# Altium project BMS Master.PrjPcb
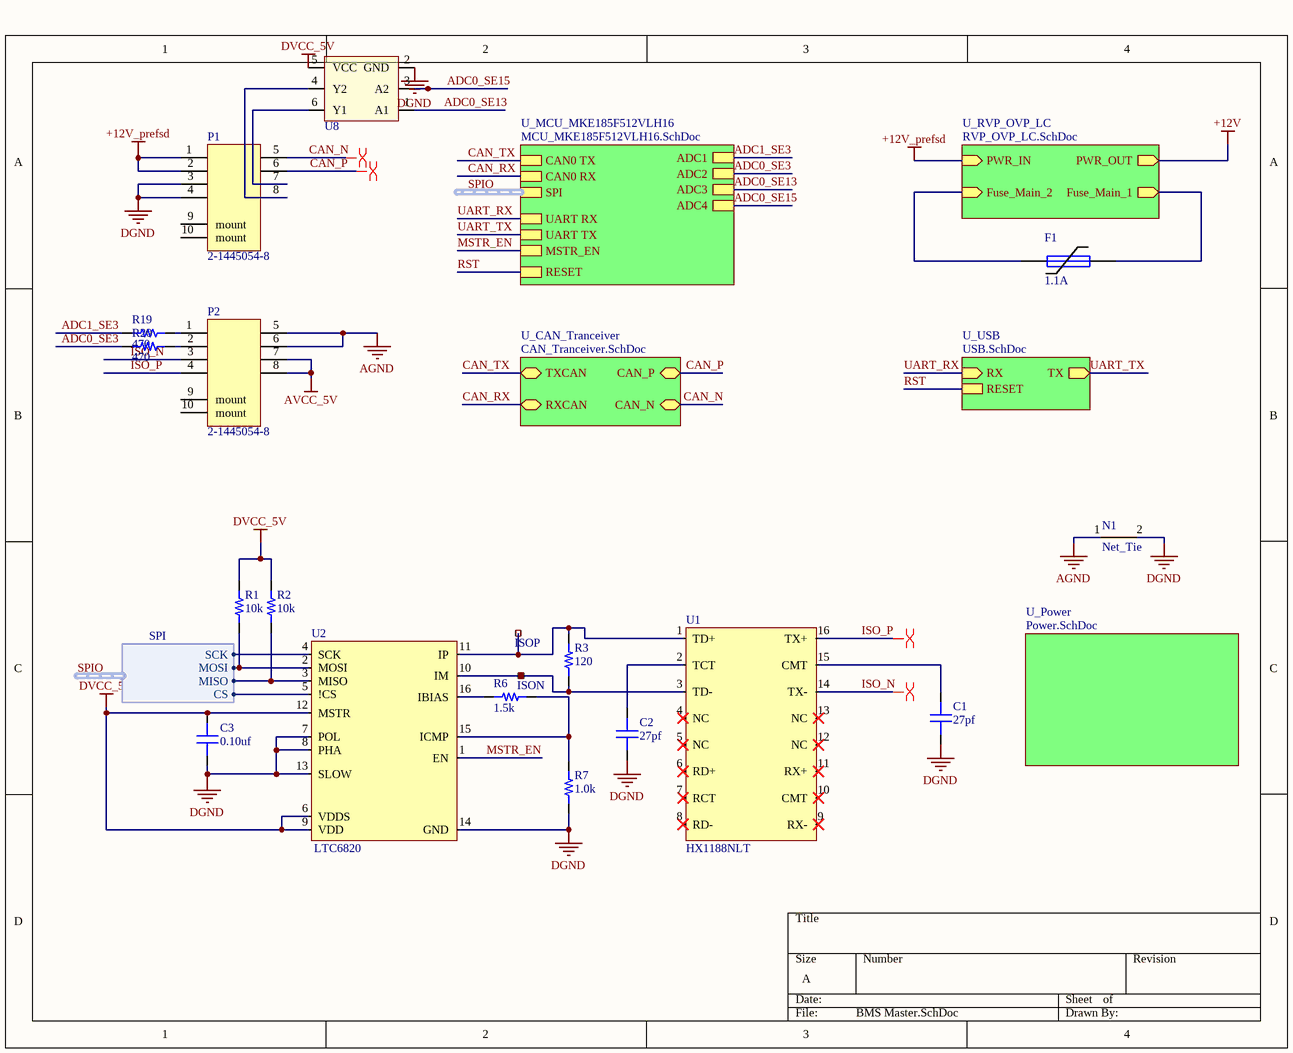
[diagram p0: BMS Master.SchDoc]
6 sheets, 76 parts. Net scope: hierarchical (ports join the sheet entries above them; power ports are global).
Board files: BMS Master.PcbDoc, BMS Master brd2.PcbDoc, BMS Master 3.PcbDoc
Sheets:
  BMS Master.SchDoc
    U_CAN_Tranceiver = CAN_Tranceiver.SchDoc
    U_RVP_OVP_LC = RVP_OVP_LC.SchDoc
    U_USB = USB.SchDoc
    U_MCU_MKE185F512VLH16 = MCU_MKE185F512VLH16.SchDoc
    U_Power = Power.SchDoc

## Sheet BMS Master.SchDoc
size A; DrawnBy: Not Alvin Ha

### Parts
C1  value 27pf  [CAP 0603/1608]  (hidden comment: Capacitor MLCC 27pf 25V CAP 0603/1608)
C2  value 27pf  [CAP 0603/1608]  (hidden comment: Capacitor MLCC 27pf 25V CAP 0603/1608)
C3  value 0.10uf  [CAP 0603/1608]  (hidden comment: Capacitor MLCC 0.10uf 25V CAP 0603/1608)
F1  I_hold: 1.1A  [PTC Fuse 1206/3216]  (hidden comment: 2.2A)
ISON  RCU-0C  [RCU-0C]  (value not drawn)
ISOP  RCU-0C  [RCU-0C]  (value not drawn)
N1  Net_Tie  [Net_Tie]  (net tie, no BOM)
P1  2-1445054-8  [2-1445054-8]
P2  2-1445054-8  [2-1445054-8]
R1  value 10k  [RES 0603/1608]  (hidden comment: Resistor 10k 0603 1/10W 5%)
R2  value 10k  [RES 0603/1608]  (hidden comment: Resistor 10k 0603 1/10W 5%)
R3  value 120  [RES 0603/1608]  (hidden comment: Resistor 120 0603 1/10W 5%)
R6  value 1.5k  [RES 0603/1608]  (hidden comment: Resistor 1.5k 0603 1/10W 5%)
R7  value 1.0k  [RES 0603/1608]  (hidden comment: Resistor 1.0k 0603 1/10W 5%)
R19  value 470  [RES 0603/1608]  (hidden comment: Resistor 470 0603 1/10W 5%)
R20  value 470  [RES 0603/1608]  (hidden comment: Resistor 470 0603 1/10W 5%)
U1  HX1188NLT  [HX1188NLT]
U2  LTC6820  [MSOP-16]
U8  comment  [6-TSSOP]  (value not drawn)

### Sub-sheets
U_CAN_Tranceiver = CAN_Tranceiver.SchDoc: TXCAN (bidir), RXCAN (bidir), CAN_P (bidir), CAN_N (bidir)
U_MCU_MKE185F512VLH16 = MCU_MKE185F512VLH16.SchDoc: CAN0 TX, CAN0 RX, ADC4, ADC3, ADC2, ADC1, SPI (harness *), MSTR_EN, UART RX, UART TX, RESET
U_Power = Power.SchDoc: no entries
U_RVP_OVP_LC = RVP_OVP_LC.SchDoc: PWR_IN (in), PWR_OUT (out), Fuse_Main_2 (in), Fuse_Main_1 (out)
U_USB = USB.SchDoc: TX (out), RX (in), RESET

### Harnesses
SPI: SCK, MOSI, MISO, CS

### Nets
+12V: F1.1 ; sheet U_RVP_OVP_LC/PWR_OUT, sheet U_RVP_OVP_LC/Fuse_Main_2
+12V_prefsd: F1.2 P1.1 P1.2 ; sheet U_RVP_OVP_LC/PWR_IN, sheet U_RVP_OVP_LC/Fuse_Main_1
AGND: N1.1 P2.5 P2.6
AVCC_5V: P2.7 P2.8
DGND: C1.1 C2.1 C3.2 N1.2 P1.3 P1.4 R7.1 U2.7(POL) U2.8(PHA) U2.13(SLOW) U2.14(GND) U8.2(GND)
DVCC_5V: C3.1 R1.2 R2.2 U2.6(VDDS) U2.9(VDD) U2.12(MSTR) U8.5(VCC)
ADC0_SE3: R20.1 ; sheet U_MCU_MKE185F512VLH16/ADC2
ADC0_SE13: U8.1(A1) ; sheet U_MCU_MKE185F512VLH16/ADC3
ADC0_SE15: U8.3(A2) ; sheet U_MCU_MKE185F512VLH16/ADC4
ADC1_SE3: R19.1 ; sheet U_MCU_MKE185F512VLH16/ADC1
CAN_N: P1.5 ; sheet U_CAN_Tranceiver/CAN_N
CAN_P: P1.6 ; sheet U_CAN_Tranceiver/CAN_P
CAN_RX: sheet U_CAN_Tranceiver/RXCAN, sheet U_MCU_MKE185F512VLH16/CAN0 RX
CAN_TX: sheet U_CAN_Tranceiver/TXCAN, sheet U_MCU_MKE185F512VLH16/CAN0 TX
cs: U2.5(!CS) ; sheet U_MCU_MKE185F512VLH16/SPI.CS
ISO_N: P2.3 U1.14(TX-)
ISO_P: P2.4 U1.16(TX+)
MSTR_EN: U2.1(EN) ; sheet U_MCU_MKE185F512VLH16/MSTR_EN
RST: sheet U_USB/RESET, sheet U_MCU_MKE185F512VLH16/RESET  [project net JTAG_RST]
SPIO.MISO: R2.1 U2.3(MISO) ; sheet U_MCU_MKE185F512VLH16/SPI.MISO
SPIO.MOSI: R1.1 U2.2(MOSI) ; sheet U_MCU_MKE185F512VLH16/SPI.MOSI
SPIO.SCK: U2.4(SCK) ; sheet U_MCU_MKE185F512VLH16/SPI.SCK
UART_RX: sheet U_USB/RX, sheet U_MCU_MKE185F512VLH16/UART RX  [project net FTDI_UART_RX]
UART_TX: sheet U_USB/TX, sheet U_MCU_MKE185F512VLH16/UART TX  [project net FTDI_UART_TX]
NetC1_2: C1.2 U1.15(CMT)
NetC2_2: C2.2 U1.2(TCT)
NetISON_1: ISON.1 R3.1 U1.3(TD-) U2.10(IM)
NetISOP_1: ISOP.1 R3.2 U1.1(TD+) U2.11(IP)
NetP1_7: P1.7 U8.6(Y1)
NetP1_8: P1.8 U8.4(Y2)
NetP2_1: P2.1 R19.2
NetP2_2: P2.2 R20.2
NetR6_1: R6.1 U2.16(IBIAS)
NetR6_2: R6.2 R7.2 U2.15(ICMP)

Not connected (* = marked no-connect by the designer): P1 9(mount) 10(mount); P2 9(mount) 10(mount); U1 4(NC)* 5(NC)* 6(RD+)* 7(RCT)* 8(RD-)* 9(RX-)* 10(CMT)* 11(RX+)* 12(NC)* 13(NC)*

### Buses and harness runs
harness SPIO = sheet U_MCU_MKE185F512VLH16/SPI

### Layout directives
differential pair: CAN_N, CAN_P, ISO_N, ISO_P

### Library data of the parts
C1 C2 = 515: Manufacturer_id: 1; idCapacitor: 515; Name: Cap_27pf_25V_CAP 0603/1608; Dielectric: Ceramic; Created_By: Nick Mah; Drawer_id: 1; Voltage_Rating: 25V; Package: CAP 0603/1608; Created_Date: 10/20/2018
C3 = 583: Manufacturer_id: 1; idCapacitor: 583; Name: Cap_0.10uf_25V_CAP 0603/1608; Dielectric: Ceramic; Created_By: Nick Mah; Drawer_id: 1; Voltage_Rating: 25V; Package: CAP 0603/1608; Created_Date: 10/20/2018
F1 = 8: Fuse; Manufacturer_id: 1; MfrPartNo: 1206L110/12SLYR; idFuse: 8; Name: Resettable; I_max: 50A; V_max: 12V; Pd_Typ: .8W; Published: 8-Jun-2000; LatestRevisionDate: 17-Jul-2002; LatestRevisionNote: Re-released for DXP Platform.; PackageReference: PIN-W2/E2.8; Publisher: Altium Limited; PackageDescription: Thru-Hole; 2 Leads; Drawer_id: 1; I_trip: 2.2A; Link: https://www.digikey.com/product-detail/en/littelfuse-inc/1206L110-12SLYR/F5764CT-ND/3593809
ISON ISOP = 14: Test point; Manufacturer_id: 1; idConn: 14; Value: CONN; Created_By: Graydon; Updated_By: Null; Drawer_id: 1; Name: RCU-0C; Num_Contacts: 1; Num_Rows: 1; Package: RCU-0C; MfrPartNo: RCU-0C; Link: https://www.digikey.com/product-detail/en/te-connectivity-amp-connectors/RCU-0C/A106145CT-ND/3477802; ComponentLink1Description: Null; ComponentLink1URL: Null; Supplier1: None; Supplier1PartNo: None; Created_Date: 11/10/2018
N1 = 1: Manufacturer_id: 1; idFuse: 3; Name: Net Tie; Drawer_id: 1; idShunt: 1
P1 P2 = 12: 1x8 connector; Manufacturer_id: 5; idConn: 12; Drawer_id: 1; Name: Micro MATE-N-LOK 1x8; Num_Contacts: 8; Created_By: Graydon; Num_Rows: 1; MfrPartNo: 2-1445054-8; Link: https://www.digikey.com/product-detail/en/te-connectivity-amp-connectors/2-1445054-8/2-1445054-8-ND/1890093; ComponentLink1Description: Datasheet; Supplier1: Digi-Key; Supplier1PartNo: 2-1445054-8-ND; Created_Date: 11/10/2018
R1 R2 = 1393: Manufacturer_id: 1; idResistor: 1393; Name: Res_10k_0603_1/10W_5%; Created_By: Nick Mah; Supplier 1: Digi-Key; Drawer_id: 1; Tolerance: 5%; Power: 1/10W; Package: 0603; ComponentLink1Description: Datasheet; Created_Date: 2018-10-20
R3 = 1347: Manufacturer_id: 1; idResistor: 1347; Name: Res_120_0603_1/10W_5%; Created_By: Nick Mah; Supplier 1: Digi-Key; Drawer_id: 1; Tolerance: 5%; Power: 1/10W; Package: 0603; ComponentLink1Description: Datasheet; Created_Date: 2018-10-20
R6 = 1373: Manufacturer_id: 1; idResistor: 1373; Name: Res_1.5k_0603_1/10W_5%; Created_By: Nick Mah; Supplier 1: Digi-Key; Drawer_id: 1; Tolerance: 5%; Power: 1/10W; Package: 0603; ComponentLink1Description: Datasheet; Created_Date: 2018-10-20
R7 = 1369: Manufacturer_id: 1; idResistor: 1369; Name: Res_1.0k_0603_1/10W_5%; Created_By: Nick Mah; Supplier 1: Digi-Key; Drawer_id: 1; Tolerance: 5%; Power: 1/10W; Package: 0603; ComponentLink1Description: Datasheet; Created_Date: 2018-10-20
R19 R20 = 1361: Manufacturer_id: 1; idResistor: 1361; Name: Res_470_0603_1/10W_5%; Created_By: Nick Mah; Supplier 1: Digi-Key; Drawer_id: 1; Tolerance: 5%; Power: 1/10W; Package: 0603; ComponentLink1Description: Datasheet; Created_Date: 2018-10-20
U1 = 8: Manufacturer_id: 1; idFuse: 3; idIC_Interface: 8; Num_Circuits: 2; Created_By: Angel; Drawer_id: 1; Name: HX1188NLT; Type: Magnetic Isolation; Package: HX1188NLT; MfrPartNo: HX1188NLT; Link: https://www.digikey.com/product-detail/en/pulse-electronics-network/HX1188NLT/553-1536-1-ND/3151809?utm_adgroup=Transformers&slid=&gclid=CjwKCAiAhp_jBRAxEiwAXbniXRrdDycXKcdMEppGgTacWMJf80VG2GQDdYxlb9yRzxEZsto0mBbjlhoCtm4QAvD_BwE
U2 = 7: soSPI Isolated / Communications Interface; Manufacturer_id: 1; idFuse: 3; idIC_Interface: 7; Protocol: isoSPI; Vin(Min): 2.7V; Vin(Max): 5.5V; Created_By: Angel; Drawer_id: 1; Name: LTC6820; Type: bidirectional; Num_Circuits: 1; Package: MSOP-16; MfrPartNo: LTC6820; Link: https://www.mouser.com/ProductDetail/Analog-Devices/LTC6820IMSPBF?qs=sGAEpiMZZMvi6wO7nhr1LyTLeBC7dAWQpR44bZH0zYY%3d
U8 = 10: Buffer dual high speed; Manufacturer_id: 1; MfrPartNo: NC7WZ07P6X; idIC_Interface: 10; Name: Buffer 2x; Value: None; Num_Circuits: 2; Data_Rate: 2.3ns; Vin(Min): 1.65V; Vin(Max): 5.5V; Created_By: gray; Updated_By: Null; Drawer_id: 1; Type: Buffer; Protocol: None; Package: 6-TSSOP; Link: https://www.digikey.com/product-detail/en/on-semiconductor/NC7WZ07P6X/NC7WZ07P6XCT-ND/965702; ComponentLink1Description: Digikey; ComponentLink1URL: https://www.digikey.com/product-detail/en/on-semiconductor/NC7WZ07P6X/NC7WZ07P6XCT-ND/965702; Supplier1: Digikey; Supplier1PartNo: NC7WZ07P6XCT-ND; Created_Date: 3/6/2019

## Sheet CAN_Tranceiver.SchDoc
size A
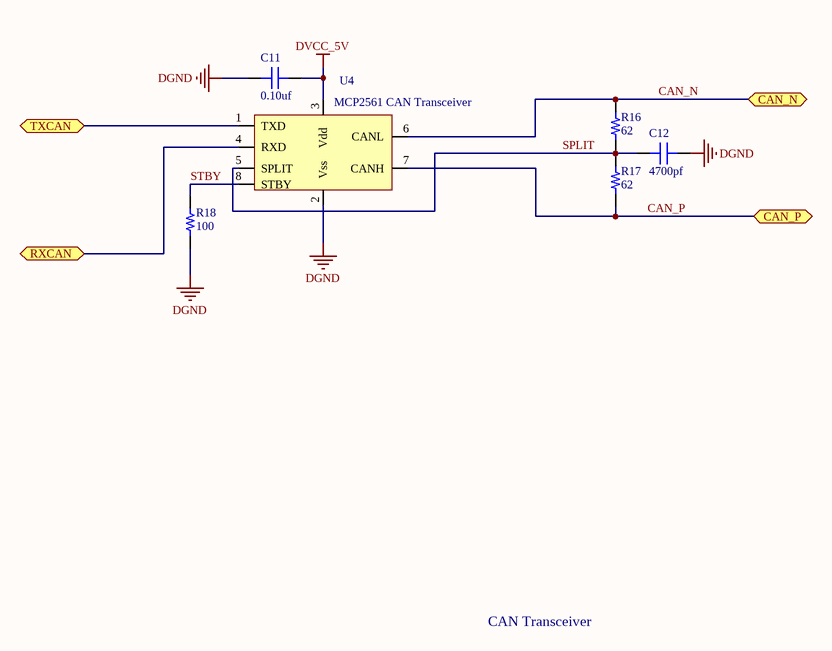
[diagram p1: CAN_Tranceiver.SchDoc]

### Parts
C11  value 0.10uf  [CAP 0603/1608]  (hidden comment: Capacitor MLCC 0.10uf 50V CAP 0603/1608)
C12  value 4700pf  [CAP 0603/1608]  (hidden comment: Capacitor MLCC 4700pf 50V CAP 0603/1608)
R16  value 62  [RES 0603/1608]  (hidden comment: Resistor 62 0603 1/10W 5%)
R17  value 62  [RES 0603/1608]  (hidden comment: Resistor 62 0603 1/10W 5%)
R18  value 100  [RES 0603/1608]  (hidden comment: Resistor 100 0603 1/10W 10%)
U4  MCP2561 CAN Transceiver  [SOIC-8]

### Ports
CAN_N (bidir), CAN_P (bidir), RXCAN (bidir), TXCAN (bidir)

### Nets
DGND: C11.1 C12.1 R18.1 U4.2(Vss)
DVCC_5V: C11.2 U4.3(Vdd)
CAN_N: R16.1 U4.6(CANL) ; port CAN_N
CAN_P: R17.2 U4.7(CANH) ; port CAN_P
CAN_RX: U4.4(RXD) ; port RXCAN
CAN_TX: U4.1(TXD) ; port TXCAN
SPLIT: C12.2 R16.2 R17.1 U4.5(SPLIT)
STBY: R18.2 U4.8(STBY)

### Notes on the sheet
- CAN Transceiver

### Library data of the parts
C11 = 943: Manufacturer_id: 1; idCapacitor: 943; Name: Cap_0.10uf_50V_CAP 0603/1608; Dielectric: Ceramic; Created_By: Nick Mah; Drawer_id: 1; Voltage_Rating: 50V; Package: CAP 0603/1608; Created_Date: 10/20/2018
C12 = 929: Manufacturer_id: 1; idCapacitor: 929; Name: Cap_4700pf_50V_CAP 0603/1608; Dielectric: Ceramic; Created_By: Nick Mah; Drawer_id: 1; Voltage_Rating: 50V; Package: CAP 0603/1608; Created_Date: 10/20/2018
R16 R17 = 1340: Manufacturer_id: 1; idResistor: 1340; Name: Res_62_0603_1/10W_5%; Created_By: Nick Mah; Supplier 1: Digi-Key; Drawer_id: 1; Tolerance: 5%; Power: 1/10W; Package: 0603; ComponentLink1Description: Datasheet; Created_Date: 2018-10-20
R18 = 2293: Manufacturer_id: 1; idResistor: 2293; Name: Res_100_0603_1/10W_10%; Created_By: Nick Mah; Supplier 1: Digi-Key; Drawer_id: 1; Tolerance: 10%; Power: 1/10W; Package: 0603; ComponentLink1Description: Datasheet; Created_Date: 2018-10-20
U4 = 5: Manufacturer_id: 1; idIC_Interface: 5; Value: CAN/UART; Data_Rate: 1Mbps; Vin(Min): 4.5V; Vin(Max): 5.5V; Created_By: Angel Delgado; Drawer_id: 1; Name: CAN Transceiver; Type: Transceiver; Protocol: CAN; Num_Circuits: 1; Package: SOIC-8; MfrPartNo: MCP2561; Link: https://www.digikey.com/product-detail/en/microchip-technology/MCP2561T-E-SN/MCP2561T-E-SNCT-ND/5148846

## Sheet RVP_OVP_LC.SchDoc
size A
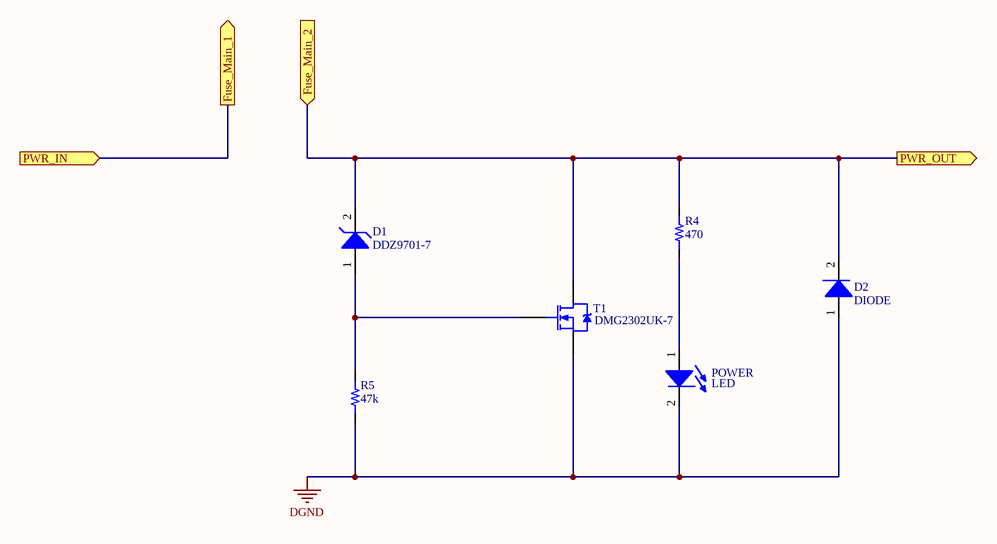
[diagram p2: RVP_OVP_LC.SchDoc]

### Parts
D1  DDZ9701-7  [SOD123F]
D2  DIODE  [SOD-128]
POWER  LED  [0805_LED]
R4  value 470  [RES 0603/1608]  (hidden comment: Resistor 470 0603 1/10W 5%)
R5  value 47k  [RES 0603/1608]  (hidden comment: Resistor 47k 0603 1/10W 5%)
T1  DMG2302UK-7  [SOT23-3]

### Ports
Fuse_Main_1 (out), Fuse_Main_2 (in), PWR_IN (in), PWR_OUT (out)

### Nets
+12V: D1.2(K) D2.2(K) R4.2 T1.3(D) ; port PWR_OUT, port Fuse_Main_2
+12V_prefsd: port PWR_IN, port Fuse_Main_1
DGND: D2.1(A) POWER.2(K) R5.1 T1.2(S)
NetD1_1: D1.1(A) R5.2 T1.1(G)
NetPOWER_1: POWER.1(A) R4.1

### Library data of the parts
D1 = 10: Zener Diode 14V 500mW ±5% Surface Mount SOD-123; Manufacturer_id: 8; idDiode: 10; Drawer_id: 1; Value: 14Vz; MfrPartNo: DDZ9701-7; Name: DDZ9701; Type: Zener; Num_Circuits: 1; Power: 500mW; Package: SOD-123; Link: https://www.digikey.com/product-detail/en/diodes-incorporated/DDZ9701-7/DDZ9701-7DICT-ND/3877402; ComponentLink1Description: Datasheet; ComponentLink1URL: https://www.diodes.com/assets/Datasheets/ds30410.pdf; Supplier1: Digi-Key; Supplier1PartNo: DDZ9701-7DICT-ND
D2 = 12: DIODE SCHOTTKY 30V 5A TMINIP2; Manufacturer_id: 1; idDiode: 12; Name: DB2431200L; Drawer_id: 1; Value: 5A; Type: Schottky; Num_Circuits: 1; Ic: 5A; Power: 30V; Package: SOD-128; MfrPartNo: DB2431200L; Link: https://www.digikey.com/product-detail/en/panasonic-electronic-components/DB2431200L/DB2431200LCT-ND/3884430; ComponentLink1Description: Datasheet; ComponentLink1URL: https://industrial.panasonic.com/content/data/SC/ds/ds4/DB2431200L_E.pdf; Supplier1: Digi-Key; Supplier1PartNo: DB2431200LCT-ND
POWER = 2: Manufacturer_id: 1; idLED: 2; Name: CMD17_0805_GREEN; Value: Green; Brightness: 7mcd; Id: 20mA; Vf: 2.1V; Drawer_id: 1; Package: 0805; Link: https://www.digikey.com/product-detail/en/visual-communications-company-vcc/CMD17-21VGD-TR8/L62505CT-ND/254936
R4 = 1361: as R19 on sheet BMS Master; Supplier 1: Digi-Key; Drawer_id: 1; Tolerance: 5%; Power: 1/10W; Package: 0603; ComponentLink1Description: Datasheet; Created_Date: 2018-10-20
R5 = 1409: Manufacturer_id: 1; idResistor: 1409; Name: Res_47k_0603_1/10W_5%; Created_By: Nick Mah; Supplier 1: Digi-Key; Drawer_id: 1; Tolerance: 5%; Power: 1/10W; Package: 0603; ComponentLink1Description: Datasheet; Created_Date: 2018-10-20
T1 = 6: MOSFET N-CHANNEL 30V 5A SOT23; Manufacturer_id: 1; idFETs: 6; Value: N_Channel; Vdss: 20V; Id: 2.8A; Rds_On: 90mOhm; Vgs(typ): 800mV; Vgs(Max): 1V; Created_By: Angel; Drawer_id: 1; Name: DMG2302UK-7; Num_Circuits: 1; Package: SOT-23; MfrPartNo: DMG2302UK-7; Link: https://www.digikey.com/product-detail/en/diodes-incorporated/DMG2302UK-7/DMG2302UK-7DICT-ND/6010163; Supplier1: Digi-Key

## Sheet USB.SchDoc
size A
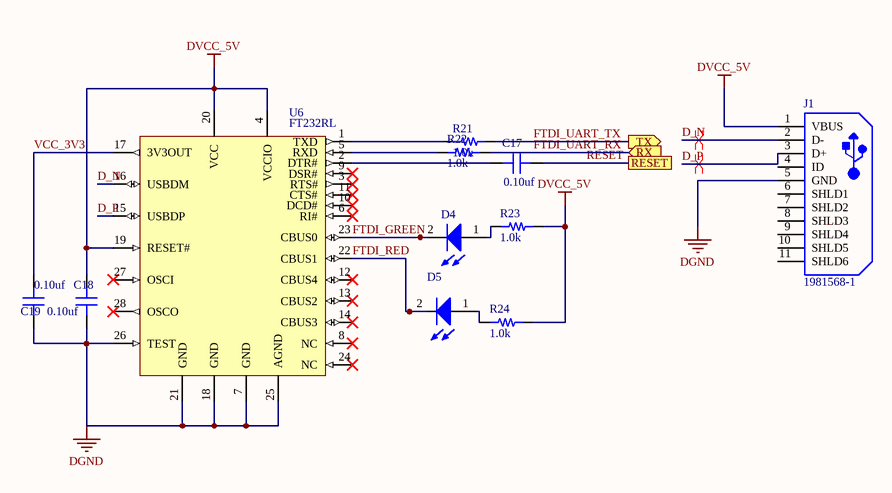
[diagram p3: USB.SchDoc]

### Parts
C17  value 0.10uf  [CAP 0603/1608]  (hidden comment: Capacitor MLCC 0.10uf 25V CAP 0603/1608)
C18  value 0.10uf  [CAP 0603/1608]  (hidden comment: Capacitor MLCC 0.10uf 25V CAP 0603/1608)
C19  value 0.10uf  [CAP 0603/1608]  (hidden comment: Capacitor MLCC 0.10uf 25V CAP 0603/1608)
D4  (no value)  [0805_LED]
D5  (no value)  [0805_LED]
J1  1981568-1  [TECO-1981568-5_V]
R21  value 1.0k  [RES 0603/1608]  (hidden comment: Resistor 1.0k 0603 1/10W 5%)
R22  value 1.0k  [RES 0603/1608]  (hidden comment: Resistor 1.0k 0603 1/10W 5%)
R23  value 1.0k  [RES 0603/1608]  (hidden comment: Resistor 1.0k 0603 1/10W 5%)
R24  value 1.0k  [RES 0603/1608]  (hidden comment: Resistor 1.0k 0603 1/10W 5%)
U6  FT232RL  [SSOP-28]

### Ports
RESET, RX (in), TX (out)

### Nets
DGND: C18.1 C19.1 J1.5(GND) U6.7(GND) U6.18(GND) U6.21(GND) U6.25(AGND) U6.26(TEST)
DVCC_5V: C18.2 J1.1(VBUS) R23.2 R24.2 U6.4(VCCIO) U6.19(RESET#) U6.20(VCC)
D_N: J1.2(D-) U6.16(USBDM)
D_P: J1.3(D+) U6.15(USBDP)
FTDI_GREEN: D4.2(K) U6.23(CBUS0)
FTDI_RED: D5.2(K) U6.22(CBUS1)
FTDI_UART_RX: R22.2 ; port RX
FTDI_UART_TX: R21.2 ; port TX
RESET: C17.2 ; port RESET  [project net JTAG_RST]
VCC_3V3: C19.2 U6.17(3V3OUT)
NetC17_1: C17.1 U6.2(DTR#)
NetD4_1: D4.1(A) R23.1
NetD5_1: D5.1(A) R24.1
NetR21_1: R21.1 U6.1(TXD)
NetR22_1: R22.1 U6.5(RXD)

Not connected (* = marked no-connect by the designer): J1 4(ID) 6(SHLD1) 7(SHLD2) 8(SHLD3) 9(SHLD4) 10(SHLD5) 11(SHLD6); U6 3(RTS#)* 6(RI#)* 8(NC)* 9(DSR#)* 10(DCD#)* 11(CTS#)* 12(CBUS4)* 13(CBUS2)* 14(CBUS3)* 24(NC)* 27(OSCI)* 28(OSCO)*

### Layout directives
differential pair; rule Matched Net Lengths [Tolerance = 0.254mm]: D_N
differential pair: D_P

### Library data of the parts
C17-C19 = 583: as C3 on sheet BMS Master; Drawer_id: 1; Voltage_Rating: 25V; Package: CAP 0603/1608; Created_Date: 10/20/2018
D4 = 2: as POWER on sheet RVP_OVP_LC; Drawer_id: 1; Link: https://www.digikey.com/product-detail/en/visual-communications-company-vcc/CMD17-21VGD-TR8/L62505CT-ND/254936; Package: 0805
D5 = 1: idLED: 1; Name: LED_0805_RED; Value: Red; Vf: 0.7V; Manufacturer_id: 1; Drawer_id: 1; Package: 0805
J1 = 5: USB Micro Type B; Manufacturer_id: 1; idConn: 5; Name: TE USB Micro; Value: CONN; Created_By: Aiku; MfrPartNo: 1981568-1; Drawer_id: 1; Num_Contacts: 5; Link: https://www.mouser.com/ProductDetail/TE-Connectivity-AMP/1981568-1?qs=sGAEpiMZZMulM8LPOQ%252bykzEIUPbUCiSfqsfxH3Oq%252bYo%3d; ComponentLink1Description: Datasheet; Supplier1: TE; Created_Date: 10/20/2018
R21-R24 = 1369: as R7 on sheet BMS Master; Supplier 1: Digi-Key; Drawer_id: 1; Tolerance: 5%; Power: 1/10W; Package: 0603; ComponentLink1Description: Datasheet; Created_Date: 2018-10-20
U6 = 3: Manufacturer_id: 1; idIC_Interface: 3; Name: USB FTDI; Protocol: UART; Vin(Min): 3.3; Vin(Max): 5.25; Created_By: Kyle; Drawer_id: 1; MfrPartNo: FT232RL; Link: https://www.digikey.com/product-detail/en/ftdi-future-technology-devices-international-ltd/FT232RL-REEL/768-1007-1-ND/1836402

## Sheet MCU_MKE185F512VLH16.SchDoc: Microcontroller
size A4; DrawnBy: Not Alvin Ha; DocumentNumber: MCU2018-2; Revision: 2.0; SheetNumber: 2; SheetTotal: 4
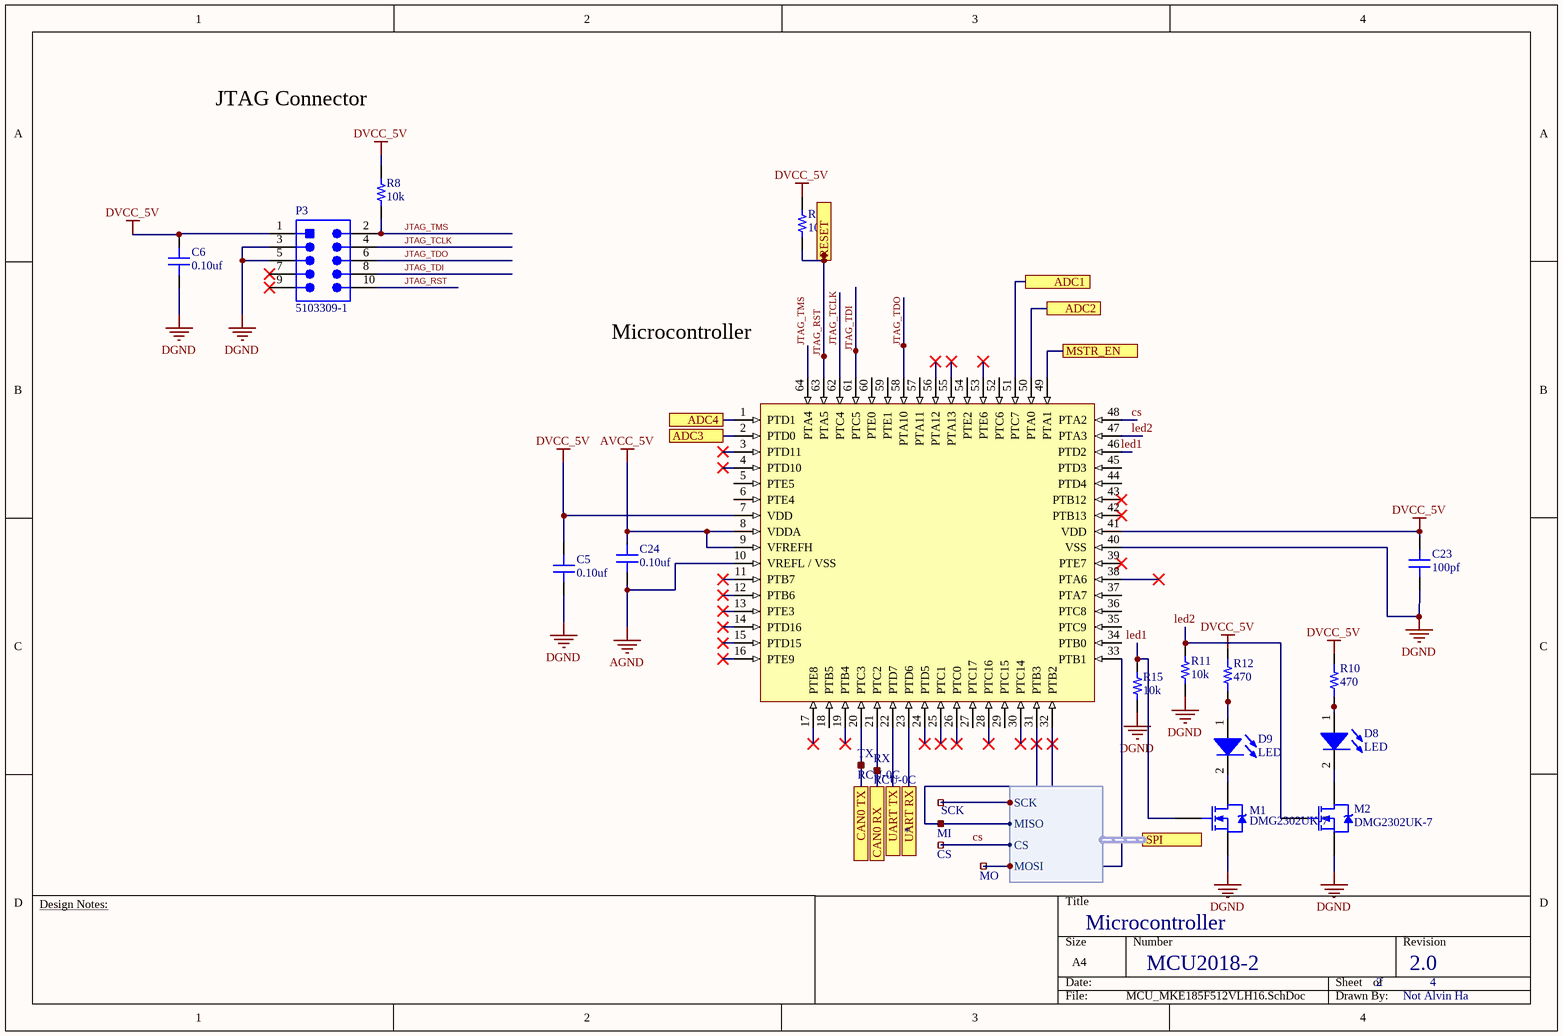
[diagram p4: MCU_MKE185F512VLH16.SchDoc]

### Parts
C5  value 0.10uf  [CAP 0603/1608]  (hidden comment: Capacitor MLCC 0.10uf 25V CAP 0603/1608)
C6  value 0.10uf  [CAP 0603/1608]  (hidden comment: Capacitor MLCC 0.10uf 16V CAP 0603/1608)
C23  value 100pf  [CAP 0603/1608]  (hidden comment: Capacitor MLCC 100pf 25V CAP 0603/1608)
C24  value 0.10uf  [CAP 0603/1608]  (hidden comment: Capacitor MLCC 0.10uf 25V CAP 0603/1608)
CS  RCU-0C  [RCU-0C]  (value not drawn)
D8  LED  [0805_LED]
D9  LED  [0805_LED]
M1  DMG2302UK-7  [SOT23-3]
M2  DMG2302UK-7  [SOT23-3]
MI  RCU-0C  [RCU-0C]  (value not drawn)
MO  RCU-0C  [RCU-0C]  (value not drawn)
P3  5103309-1  [HDR2X5_SMT]
R8  value 10k  [RES 0603/1608]  (hidden comment: Resistor 10k 0603 1/10W 1%)
R9  value 10k  [RES 0603/1608]  (hidden comment: Resistor 10k 0603 1/10W 5%)
R10  value 470  [RES 0603/1608]  (hidden comment: Resistor 470 0603 1/10W 5%)
R11  value 10k  [RES 0603/1608]  (hidden comment: Resistor 10k 0603 1/10W 1%)
R12  value 470  [RES 0603/1608]  (hidden comment: Resistor 470 0603 1/10W 5%)
R15  value 10k  [RES 0603/1608]  (hidden comment: Resistor 10k 0603 1/10W 1%)
RX  RCU-0C  [RCU-0C]
SCK  RCU-0C  [RCU-0C]  (value not drawn)
TX  RCU-0C  [RCU-0C]
U7  (no value)  [TQFP64]

### Ports
ADC1, ADC2, ADC3, ADC4, CAN0 RX, CAN0 TX, MSTR_EN, RESET, SPI (harness *), UART RX, UART TX

### Harnesses
*: SCK, MISO, CS, MOSI

### Nets
AGND: C24.1 U7.10(VREFL_/_VSS)
AVCC_5V: C24.2 U7.8(VDDA) U7.9(VFREFH)
DGND: C5.1 C6.1 C23.1 M1.2(S) M2.2(S) P3.3 P3.5 R11.1 R15.1 U7.40(VSS)
DVCC_5V: C5.2 C6.2 C23.2 P3.1 R8.2 R9.2 R10.2 R12.2 U7.7(VDD) U7.41(VDD)
ADC0_SE3: U7.50(PTA0) ; port ADC2
ADC0_SE13: U7.2(PTD0) ; port ADC3
ADC0_SE15: U7.1(PTD1) ; port ADC4
ADC1_SE3: U7.51(PTC7) ; port ADC1
CAN_RX: RX.1 U7.21(PTC2) ; port CAN0 RX
CAN_TX: TX.1 U7.20(PTC3) ; port CAN0 TX
cs: CS.1 U7.48(PTA2) ; port SPI.CS
FTDI_UART_RX: U7.23(PTD6) ; port UART RX
FTDI_UART_TX: U7.22(PTD7) ; port UART TX
JTAG_RST: P3.10 R9.1 U7.63(PTA5) ; port RESET
JTAG_TCLK: P3.4 U7.62(PTC4)
JTAG_TDI: P3.8 U7.61(PTC5)
JTAG_TDO: P3.6 U7.58(PTA10)
JTAG_TMS: P3.2 R8.1 U7.64(PTA4)
led1: M1.1(G) R15.2 U7.46(PTD2)
led2: M2.1(G) R11.2 U7.47(PTA3)
MSTR_EN: U7.49(PTA1) ; port MSTR_EN
SPIO.MISO: MI.1 U7.31(PTB3) ; port SPI.MISO
SPIO.MOSI: MO.1 U7.33(PTB1) ; port SPI.MOSI
SPIO.SCK: SCK.1 U7.32(PTB2) ; port SPI.SCK
NetD8_1: D8.1(A) R10.1
NetD8_2: D8.2(K) M2.3(D)
NetD9_1: D9.1(A) R12.1
NetD9_2: D9.2(K) M1.3(D)

Not connected (* = marked no-connect by the designer): P3 7* 9*; U7 3(PTD11)* 4(PTD10)* 5(PTE5) 6(PTE4) 11(PTB7)* 12(PTB6)* 13(PTE3)* 14(PTD16)* 15(PTD15)* 16(PTE9)* 17(PTE8)* 18(PTB5) 19(PTB4)* 24(PTD5)* 25(PTC1)* 26(PTC0)* 27(PTC17) 28(PTC16)* 29(PTC15) 30(PTC14)* 34(PTB0) 35(PTC9) 36(PTC8) 37(PTA7) 38(PTA6)* 39(PTE7)* 42(PTB13)* 43(PTB12)* 44(PTD4) 45(PTD3) 52(PTC6) 53(PTE6)* 54(PTE2) 55(PTA13)* 56(PTA12)* 57(PTA11) 59(PTE1) 60(PTE0)

### Notes on the sheet
- JTAG Connector
- Microcontroller
- Design Notes:

### Library data of the parts
C5 C24 = 583: as C3 on sheet BMS Master; Drawer_id: 1; Voltage_Rating: 25V; Package: CAP 0603/1608; Created_Date: 10/20/2018
C6 = 223: Manufacturer_id: 1; idCapacitor: 223; Name: Cap_0.10uf_16V_CAP 0603/1608; Dielectric: Ceramic; Created_By: Nick Mah; Drawer_id: 1; Voltage_Rating: 16V; Package: CAP 0603/1608; Created_Date: 10/20/2018
C23 = 529: Manufacturer_id: 1; idCapacitor: 529; Name: Cap_100pf_25V_CAP 0603/1608; Dielectric: Ceramic; Created_By: Nick Mah; Drawer_id: 1; Voltage_Rating: 25V; Package: CAP 0603/1608; Created_Date: 10/20/2018
CS MI MO RX SCK TX = 5: Manufacturer_id: 1; idTable: 5; Name: RCU-0C_Test_Point; Drawer_id: 1; Package: 0603; MfrPartNo: RCU-0C; Link: https://www.digikey.com/product-detail/en/te-connectivity-amp-connectors/RCU-0C/A106145CT-ND/3477802; ComponentLink1Description: Datasheet; ComponentLink1URL: https://www.te.com/commerce/DocumentDelivery/DDEController?Action=srchrtrv&DocNm=1773266&DocType=DS&DocLang=English
D8 D9 = 2: as POWER on sheet RVP_OVP_LC; Drawer_id: 1; Package: 0805; Link: https://www.digikey.com/product-detail/en/visual-communications-company-vcc/CMD17-21VGD-TR8/L62505CT-ND/254936
M1 M2 = 6: as T1 on sheet RVP_OVP_LC; MfrPartNo: DMG2302UK-7; Drawer_id: 1; Name: DMG2302UK-7; Num_Circuits: 1; Package: SOT-23; Link: https://www.digikey.com/product-detail/en/diodes-incorporated/DMG2302UK-7/DMG2302UK-7DICT-ND/6010163; Supplier1: Digi-Key
P3 = 4: 2 row connector; Manufacturer_id: 1; idConn: 4; Name: CONN_TE_2X5POS; Value: CONN; Voltage_Rating: None; Num_Contacts: 10; Num_Rows: 2; Pitch: 2.54mm; Created_By: Aiku; Drawer_id: 1; MfrPartNo: 5103309-1; Link: https://www.digikey.com/product-detail/en/5103309-1/A33160-ND/1114898?utm_campaign=buynow&WT.z_cid=ref_octopart_dkc_buynow&utm_medium=aggregator&curr=usd&site=us&utm_source=octopart; ComponentLink1Description: Datasheet
R8 R11 R15 = 313: Manufacturer_id: 1; idResistor: 313; Name: Res_10k_0603_1/10W_1%; Created_By: Nick Mah; Supplier 1: Digi-Key; Drawer_id: 1; Tolerance: 1%; Power: 1/10W; Package: 0603; ComponentLink1Description: Datasheet; Created_Date: 2018-10-20
R9 = 1393: as R1 on sheet BMS Master; Supplier 1: Digi-Key; Drawer_id: 1; Tolerance: 5%; Power: 1/10W; Package: 0603; ComponentLink1Description: Datasheet; Created_Date: 2018-10-20
R10 R12 = 1361: as R19 on sheet BMS Master; Supplier 1: Digi-Key; Drawer_id: 1; Tolerance: 5%; Power: 1/10W; Package: 0603; ComponentLink1Description: Datasheet; Created_Date: 2018-10-20
U7 = 1: idMCU: 1; Name: MKE18F512VLH16 MCU; Manufacturer_id: 1; Drawer_id: 1

## Sheet Power.SchDoc
size A
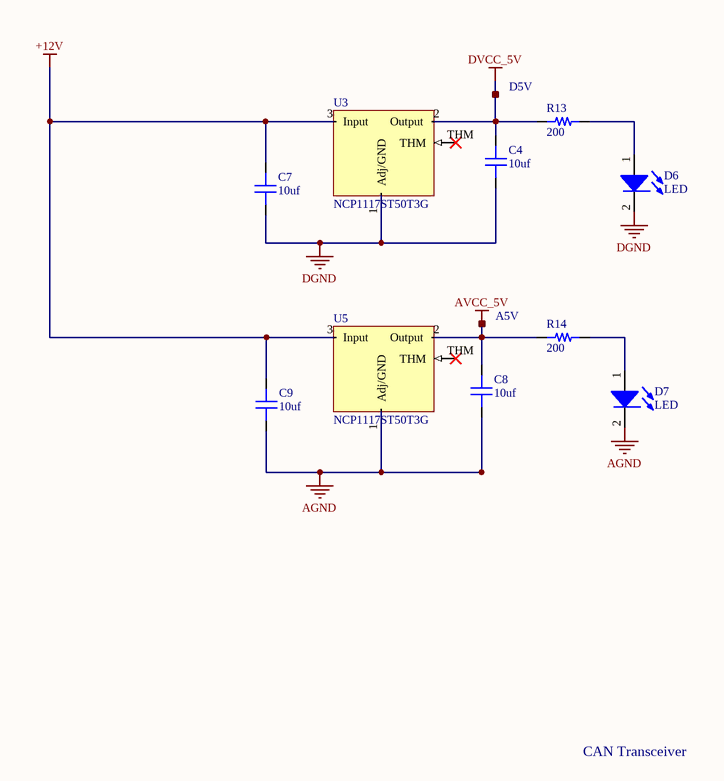
[diagram p5: Power.SchDoc]

### Parts
A5V  RCU-0C  [RCU-0C]  (value not drawn)
C4  value 10uf  [CAP 0603/1608]  (hidden comment: Capacitor MLCC 10uf 25V CAP 0603/1608)
C7  value 10uf  [CAP 0603/1608]  (hidden comment: Capacitor MLCC 10uf 25V CAP 0603/1608)
C8  value 10uf  [CAP 0603/1608]  (hidden comment: Capacitor MLCC 10uf 25V CAP 0603/1608)
C9  value 10uf  [CAP 0603/1608]  (hidden comment: Capacitor MLCC 10uf 25V CAP 0603/1608)
D5V  RCU-0C  [RCU-0C]  (value not drawn)
D6  LED  [0805_LED]
D7  LED  [0805_LED]
R13  value 200  [RES 0603/1608]  (hidden comment: Resistor 200 0603 1/10W 5%)
R14  value 200  [RES 0603/1608]  (hidden comment: Resistor 200 0603 1/10W 5%)
U3  NCP1117ST50T3G  [SOT-223-3]
U5  NCP1117ST50T3G  [SOT-223-3]

### Nets
+12V: C7.2 C9.2 U3.3(Input) U5.3(Input)
AGND: C8.1 C9.1 D7.2(K) U5.1(Adj/GND)
AVCC_5V: A5V.1 C8.2 R14.1 U5.2(Output)
DGND: C4.1 C7.1 D6.2(K) U3.1(Adj/GND)
DVCC_5V: C4.2 D5V.1 R13.1 U3.2(Output)
NetD6_1: D6.1(A) R13.2
NetD7_1: D7.1(A) R14.2

Not connected (* = marked no-connect by the designer): U3 THM*; U5 THM*

### Notes on the sheet
- CAN Transceiver

### Library data of the parts
A5V D5V = 5: as CS on sheet MCU_MKE185F512VLH16; Drawer_id: 1; Package: 0603; MfrPartNo: RCU-0C; Link: https://www.digikey.com/product-detail/en/te-connectivity-amp-connectors/RCU-0C/A106145CT-ND/3477802; ComponentLink1Description: Datasheet; ComponentLink1URL: https://www.te.com/commerce/DocumentDelivery/DDEController?Action=srchrtrv&DocNm=1773266&DocType=DS&DocLang=English
C4 C7-C9 = 595: Manufacturer_id: 1; idCapacitor: 595; Name: Cap_10uf_25V_CAP 0603/1608; Dielectric: Ceramic; Created_By: Nick Mah; Drawer_id: 1; Voltage_Rating: 25V; Package: CAP 0603/1608; Created_Date: 10/20/2018
D6 = 1: as D5 on sheet USB; Manufacturer_id: 1; Drawer_id: 1; Package: 0805
D7 = 2: as POWER on sheet RVP_OVP_LC; Drawer_id: 1; Package: 0805; Link: https://www.digikey.com/product-detail/en/visual-communications-company-vcc/CMD17-21VGD-TR8/L62505CT-ND/254936
R13 R14 = 1352: Manufacturer_id: 1; idResistor: 1352; Name: Res_200_0603_1/10W_5%; Created_By: Nick Mah; Supplier 1: Digi-Key; Drawer_id: 1; Tolerance: 5%; Power: 1/10W; Package: 0603; ComponentLink1Description: Datasheet; Created_Date: 2018-10-20
U3 U5 = 16: Linear Voltage Regulator IC Positive Fixed 1 Output 5V 1A SOT-223; Manufacturer_id: 1; idPMIC_Lin: 16; Name: 5V 1A LDO; Value: 5V 1.0A; Output_Config: 5V Fixed; Vin(Max): 20V; Vout(Min): 4.95; Vout(Max): 5.05; Dropout_Voltage: 1.2V @ 800mA; Created_By: Angel Delgado; Drawer_id: 1; Num_Outputs: 1; Vout_Type: Fixed; Current_Rating: 1A; Package: SOT-223-3; MfrPartNo: NCP1117ST50T3G; Link: https://www.digikey.com/product-detail/en/on-semiconductor/NCP1117ST50T3G/NCP1117ST50T3GOSCT-ND/1967217; ComponentLink1Description: Datasheet; ComponentLink1URL: https://www.onsemi.com/pub/Collateral/NCP1117-D.PDF

## Nets that join several sheets
+12V: BMS Master (F1.1), RVP_OVP_LC (D1.2 D2.2 R4.2 T1.3), Power (C7.2 C9.2 U3.3 U5.3)
AGND: BMS Master (N1.1 P2.5 P2.6), MCU_MKE185F512VLH16 (C24.1 U7.10), Power (C8.1 C9.1 D7.2 U5.1)
AVCC_5V: BMS Master (P2.7 P2.8), MCU_MKE185F512VLH16 (C24.2 U7.8 U7.9), Power (A5V.1 C8.2 R14.1 U5.2)
DGND: BMS Master (12 pins), CAN_Tranceiver (C11.1 C12.1 R18.1 U4.2), RVP_OVP_LC (D2.1 POWER.2 R5.1 T1.2), USB (8 pins), MCU_MKE185F512VLH16 (10 pins), Power (C4.1 C7.1 D6.2 U3.1)
DVCC_5V: BMS Master (7 pins), CAN_Tranceiver (C11.2 U4.3), USB (7 pins), MCU_MKE185F512VLH16 (10 pins), Power (C4.2 D5V.1 R13.1 U3.2)
ADC0_SE3: BMS Master (R20.1), MCU_MKE185F512VLH16 (U7.50)
ADC0_SE13: BMS Master (U8.1), MCU_MKE185F512VLH16 (U7.2)
ADC0_SE15: BMS Master (U8.3), MCU_MKE185F512VLH16 (U7.1)
ADC1_SE3: BMS Master (R19.1), MCU_MKE185F512VLH16 (U7.51)
CAN_N: BMS Master (P1.5), CAN_Tranceiver (R16.1 U4.6)
CAN_P: BMS Master (P1.6), CAN_Tranceiver (R17.2 U4.7)
CAN_RX: CAN_Tranceiver (U4.4), MCU_MKE185F512VLH16 (RX.1 U7.21)
CAN_TX: CAN_Tranceiver (U4.1), MCU_MKE185F512VLH16 (TX.1 U7.20)
cs: BMS Master (U2.5), MCU_MKE185F512VLH16 (CS.1 U7.48)
FTDI_UART_RX: USB (R22.2), MCU_MKE185F512VLH16 (U7.23)
FTDI_UART_TX: USB (R21.2), MCU_MKE185F512VLH16 (U7.22)
JTAG_RST: USB (C17.2), MCU_MKE185F512VLH16 (P3.10 R9.1 U7.63)
MSTR_EN: BMS Master (U2.1), MCU_MKE185F512VLH16 (U7.49)
SPIO.MISO: BMS Master (R2.1 U2.3), MCU_MKE185F512VLH16 (MI.1 U7.31)
SPIO.MOSI: BMS Master (R1.1 U2.2), MCU_MKE185F512VLH16 (MO.1 U7.33)
SPIO.SCK: BMS Master (U2.4), MCU_MKE185F512VLH16 (SCK.1 U7.32)